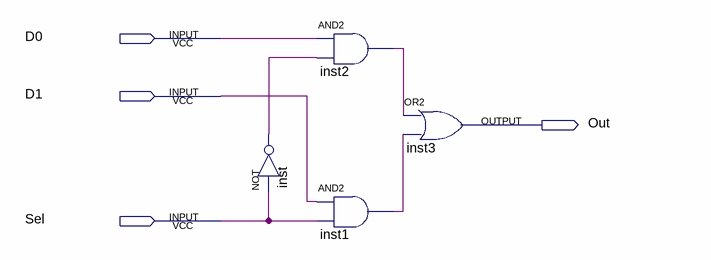
[diagram p0: schematic sheet]
// Quartus schematic mux2_1b.bdf as structural Verilog: 4 symbols, 4 pins
module mux2_1b (
  input  D0,
  input  D1,
  input  Sel,
  output Out
);

  wire inst1_out, inst2_out, inst_out;

  not inst (inst_out, Sel);
  and inst2 (inst2_out, D0, inst_out);
  and inst1 (inst1_out, D1, Sel);
  or inst3 (Out, inst2_out, inst1_out);
endmodule
